# Altium schematic sheet Carte_Geolocalisation.SchDoc: Schema Carte Geolocalisation
size A4; Organization: Altium Limited; Address1: L3, 12a Rodborough Rd; Address2: Frenchs Forest; Address3: NSW; Address4: Australia 2086
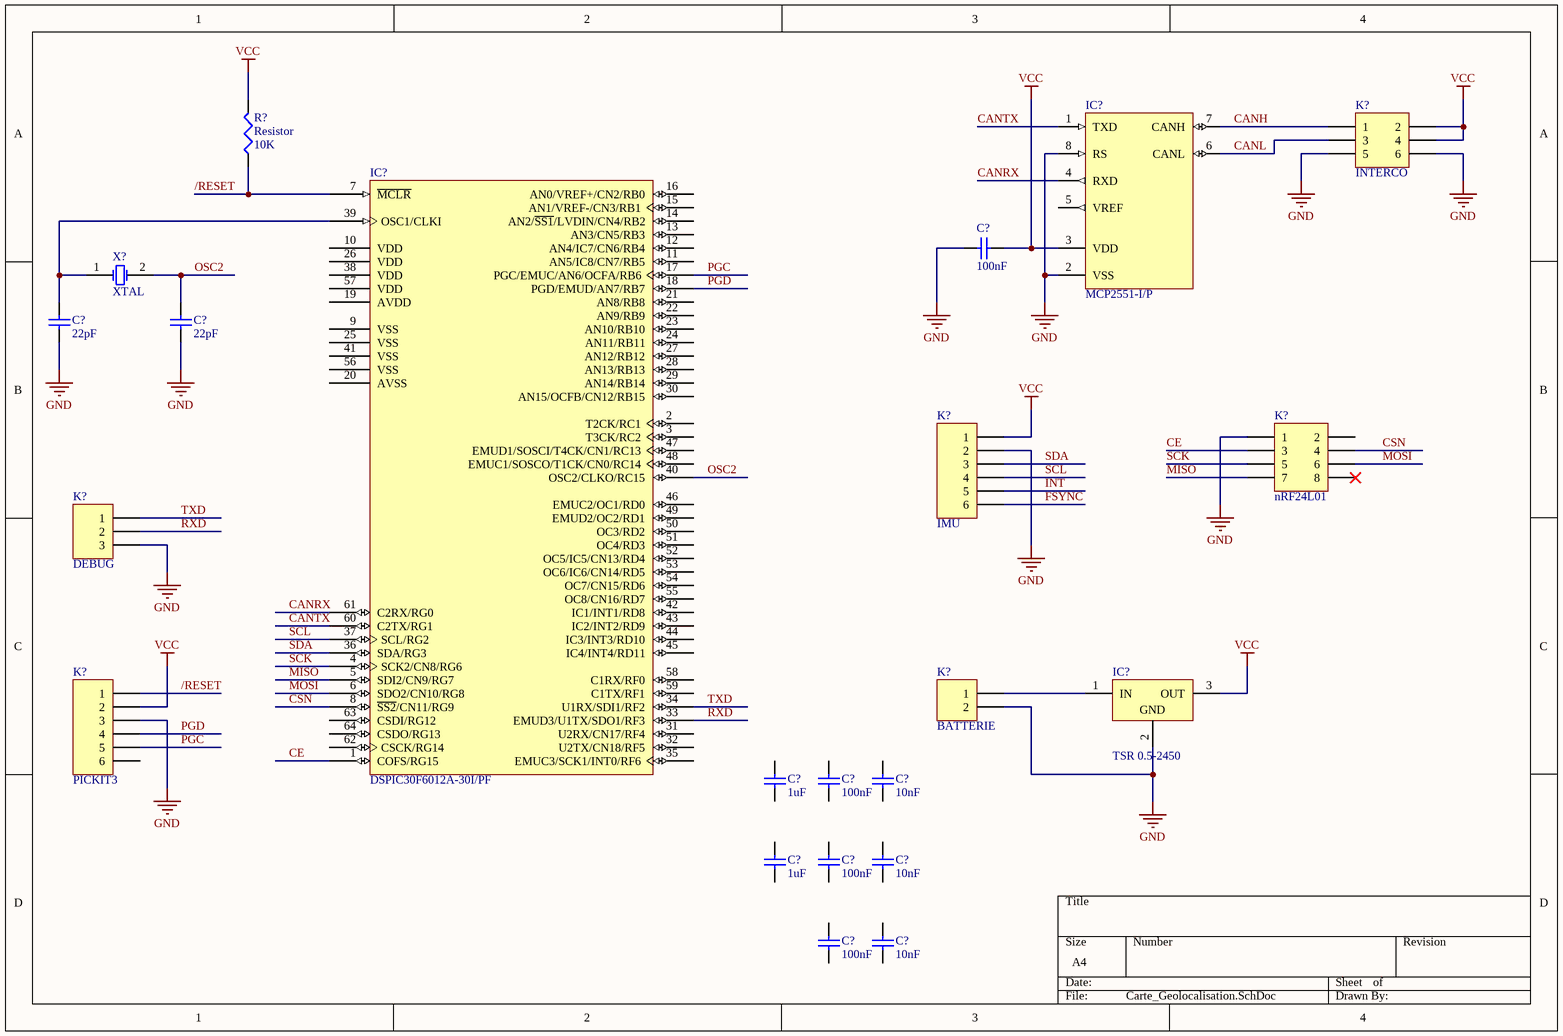
[diagram p0: Carte_Geolocalisation.SchDoc]

## Parts
(Parts that share a designator on the sheet are numbered #1, #2 ... from top to bottom, then left to right.)
C?#1  value 100nF  [Cap tantal 5mm pitch]  (hidden comment: Capacitor tantal)
C?#2  value 22pF  [Cap tantal 5mm pitch]  (hidden comment: Capacitor tantal)
C?#3  value 22pF  [Cap tantal 5mm pitch]  (hidden comment: Capacitor tantal)
C?#4  value 1uF  [Cap tantal 5mm pitch]  (hidden comment: Capacitor tantal)
C?#5  value 100nF  [Cap tantal 5mm pitch]  (hidden comment: Capacitor tantal)
C?#6  value 10nF  [Cap tantal 5mm pitch]  (hidden comment: Capacitor tantal)
C?#7  value 1uF  [Cap tantal 5mm pitch]  (hidden comment: Capacitor tantal)
C?#8  value 100nF  [Cap tantal 5mm pitch]  (hidden comment: Capacitor tantal)
C?#9  value 10nF  [Cap tantal 5mm pitch]  (hidden comment: Capacitor tantal)
C?#10  value 100nF  [Cap tantal 5mm pitch]  (hidden comment: Capacitor tantal)
C?#11  value 10nF  [Cap tantal 5mm pitch]  (hidden comment: Capacitor tantal)
IC?#1  MCP2551-I/P  [PDIP300-P8]
IC?#2  DSPIC30F6012A-30I/PF  [TQFP-PF64_N]
IC?#3  TSR 0.5-2450  [TO-220A]
K?#1  INTERCO  [HDR2X3]
K?#2  IMU  [HDR1X6]
K?#3  nRF24L01  [HDR2X4]
K?#4  DEBUG  [HDR1X3]
K?#5  PICKIT3  [HDR1X6]
K?#6  BATTERIE  [HDR1X2]
R?  Resistor  value 10K  [0402]
X?  XTAL  [R38]

## Nets
GND: C?#1.2 C?#2.1 C?#3.1 IC?#1.2(VSS) IC?#1.8(RS) IC?#3.2(GND) K?#1.5 K?#1.6 K?#2.2 K?#3.1 K?#4.3 K?#5.3 K?#6.2
VCC: C?#1.1 IC?#1.3(VDD) IC?#3.3(OUT) K?#1.2 K?#1.4 K?#2.1 K?#5.2 R?.2
/RESET: IC?#2.7(~{MCLR}) K?#5.1 R?.1
CANH: IC?#1.7(CANH) K?#1.1
CANL: IC?#1.6(CANL) K?#1.3
CANRX: IC?#1.4(RXD) IC?#2.61(C2RX/RG0)
CANTX: IC?#1.1(TXD) IC?#2.60(C2TX/RG1)
CE: IC?#2.1(COFS/RG15) K?#3.3
CSN: IC?#2.8(~{SS2}/CN11/RG9) K?#3.4
FSYNC: K?#2.6
INT: K?#2.5
MISO: IC?#2.5(SDI2/CN9/RG7) K?#3.7
MOSI: IC?#2.6(SDO2/CN10/RG8) K?#3.6
OSC2: C?#3.2 IC?#2.40(OSC2/CLKO/RC15) X?.2(OSC2)
PGC: IC?#2.17(PGC/EMUC/AN6/OCFA/RB6) K?#5.5
PGD: IC?#2.18(PGD/EMUD/AN7/RB7) K?#5.4
RXD: IC?#2.33(EMUD3/U1TX/SDO1/RF3) K?#4.2
SCK: IC?#2.4(SCK2/CN8/RG6) K?#3.5
SCL: IC?#2.37(SCL/RG2) K?#2.4
SDA: IC?#2.36(SDA/RG3) K?#2.3
TXD: IC?#2.34(U1RX/SDI1/RF2) K?#4.1
NetC?#2_2: C?#2.2 IC?#2.39(OSC1/CLKI) X?.1(OSC1)
NetIC?#3_1: IC?#3.1(IN) K?#6.1

Not connected (* = marked no-connect by the designer): C?#4 1 2; C?#5 1 2; C?#6 1 2; C?#7 1 2; C?#8 1 2; C?#9 1 2; C?#10 1 2; C?#11 1 2; IC?#1 5(VREF); IC?#2 2(T2CK/RC1) 3(T3CK/RC2) 9(VSS) 10(VDD) 11(AN5/IC8/CN7/RB5) 12(AN4/IC7/CN6/RB4) 13(AN3/CN5/RB3) 14(AN2/~{SS1}/LVDIN/CN4/RB2) 15(AN1/VREF-/CN3/RB1) 16(AN0/VREF+/CN2/RB0) 19(AVDD) 20(AVSS) 21(AN8/RB8) 22(AN9/RB9) 23(AN10/RB10) 24(AN11/RB11) 25(VSS) 26(VDD) 27(AN12/RB12) 28(AN13/RB13) 29(AN14/RB14) 30(AN15/OCFB/CN12/RB15) 31(U2RX/CN17/RF4) 32(U2TX/CN18/RF5) 35(EMUC3/SCK1/INT0/RF6) 38(VDD) 41(VSS) 42(IC1/INT1/RD8) 43(IC2/INT2/RD9) 44(IC3/INT3/RD10) 45(IC4/INT4/RD11) 46(EMUC2/OC1/RD0) 47(EMUD1/SOSCI/T4CK/CN1/RC13) 48(EMUC1/SOSCO/T1CK/CN0/RC14) 49(EMUD2/OC2/RD1) 50(OC3/RD2) 51(OC4/RD3) 52(OC5/IC5/CN13/RD4) 53(OC6/IC6/CN14/RD5) 54(OC7/CN15/RD6) 55(OC8/CN16/RD7) 56(VSS) 57(VDD) 58(C1RX/RF0) 59(C1TX/RF1) 62(CSCK/RG14) 63(CSDI/RG12) 64(CSDO/RG13); K?#3 2 8*; K?#5 6

## Notes on the sheet
- Title
- Size:
- Date:
- A4
- Number:
- Time:
- Revision:
- Sheet
- of
- File:

## Library data of the parts
C?#1-C?#11 = Capacitor tantal: Capacitor; Published: 8-Jun-2000; LatestRevisionDate: 29-May-2009; LatestRevisionNote: IPC-7351 Footprint Added.; PackageReference: C0805; Publisher: Altium Limited; PackageDescription: Chip Capacitor
IC?#1 = MCP2551-I/P: High-Speed CAN Transceiver, 8-Pin PDIP, Industrial Temperature; Published: 29-Jan-2009; DatasheetVersion: revE, Jan-2007; PackageVersion: revBB, Aug-2009; PackageReference: PDIP300-P8; Publisher: Altium Limited; PackageDescription: 8-Lead Plastic Dual In-Line (P) - 300 mil Body [PDIP]; Supplier 1: Digi-Key; Supplier Part Number 1: MCP2551-I/P-ND; Supplier 2: Farnell; Supplier Part Number 2: 1292240; Code_JEDEC: MS-001; ComponentLink1Description: Datasheet; ComponentLink1URL: http://ww1.microchip.com/downloads/en/DeviceDoc/21667E.pdf; ComponentLink2Description: Packaging Specification; ComponentLink2URL: http://www.microchip.com/stellent/groups/techpub_sg/documents/packagingspec/en012702.pdf; ComponentLink3Description: Microchip.com Home; ComponentLink3URL: http://www.microchip.com/
IC?#2 = DSPIC30F6012A-30I/PF: High-Performance 16-bit Digital Signal Controller, 144 KB Flash, 8 KB SRAM, 4 KB EEPROM, 64-Pin TQFP, Industrial Temperature; Published: 29-Jan-2009; DatasheetVersion: revD, Jul-2008; PackageVersion: revBB, Aug-2009; PackageReference: TQFP-PF64; Publisher: Altium Limited; PackageDescription: 64-Lead Plastic Thin Quad Flatpack (PF) - 14x14x1mm Body, 2.00mm [TQFP]; Supplier 1: Digi-Key; Supplier Part Number 1: DSPIC30F6012A-30I/PF-ND; Supplier 2: Farnell; Supplier Part Number 2: 1262779; Supplier 3: Farnell; Supplier Part Number 3: 1467795; Code_JEDEC: MS-026-AEB; ComponentLink1Description: Datasheet; ComponentLink1URL: http://ww1.microchip.com/downloads/en/DeviceDoc/70143D.pdf; ComponentLink2Description: Packaging Specification; ComponentLink2URL: http://www.microchip.com/stellent/groups/techpub_sg/documents/packagingspec/en012702.pdf; ComponentLink3Description: Microchip.com Home; ComponentLink3URL: http://www.microchip.com/
IC?#3 = MC7805CT: +5V Voltage Regulator; Note: Heatsink surface is connected to Pin 2; Published: 15-Apr-2002; DatasheetVersion: 1997; PackageVersion: 1997; PackageReference: 221A-06; Publisher: Altium Limited; PackageDescription: TO, Thru-Hole, Vertical, Heatsink Mounted; 3 In-Line Leads; Pitch 2.54 mm; Code_JEDEC: TO-262-AA; ComponentLink1Description: Manufacturer Link; ComponentLink1URL: http://www.onsemi.com/site/products/taxonomy/0,4438,503,00.html; ComponentLink2Description: Datasheet; ComponentLink2URL: http://www.onsemi.com/pub/Collateral/MC7800-D.PDF; Supplier 1: RS-Components; Supplier 2: Farnell; Supplier Part Number 1: 516-4799; Supplier Part Number 2: 1696994
K?#1 = Header 3X2: Header, 3-Pin, Dual row; LatestRevisionDate: 17-Jul-2002; LatestRevisionNote: Re-released for DXP Platform.; Publisher: Altium Limited
K?#2 K?#5 = Header 6: Header, 6-Pin; LatestRevisionDate: 17-Jul-2002; LatestRevisionNote: Re-released for DXP Platform.; Publisher: Altium Limited
K?#3 = Header 4X2: Header, 4-Pin, Dual row; LatestRevisionDate: 17-Jul-2002; LatestRevisionNote: Re-released for DXP Platform.; Publisher: Altium Limited
K?#4 = Header 3: Header, 3-Pin; LatestRevisionDate: 17-Jul-2002; LatestRevisionNote: Re-released for DXP Platform.; Publisher: Altium Limited
K?#6 = Header 2: Header, 2-Pin; LatestRevisionDate: 17-Jul-2002; LatestRevisionNote: Re-released for DXP Platform.; Publisher: Altium Limited
X? = XTAL: Crystal Oscillator; Published: 8-Jun-2000; LatestRevisionDate: 17-Jul-2002; LatestRevisionNote: Re-released for DXP Platform.; PackageReference: R38; Publisher: Altium Limited; PackageDescription: Crystal, Thru-Hole; 2 Leads; Body 3.1 x 8.2 mm (Dia.xH)
R? = Resistor: Published: 8-Jun-2000; LatestRevisionDate: 29-May-2009; LatestRevisionNote: IPC-7351 Footprint Added.; PackageReference: J1-0603; Publisher: Altium Limited; PackageDescription: Chip Resistor